# EAGLE design MarazLiteKumanda (EAGLE 9.6.1)
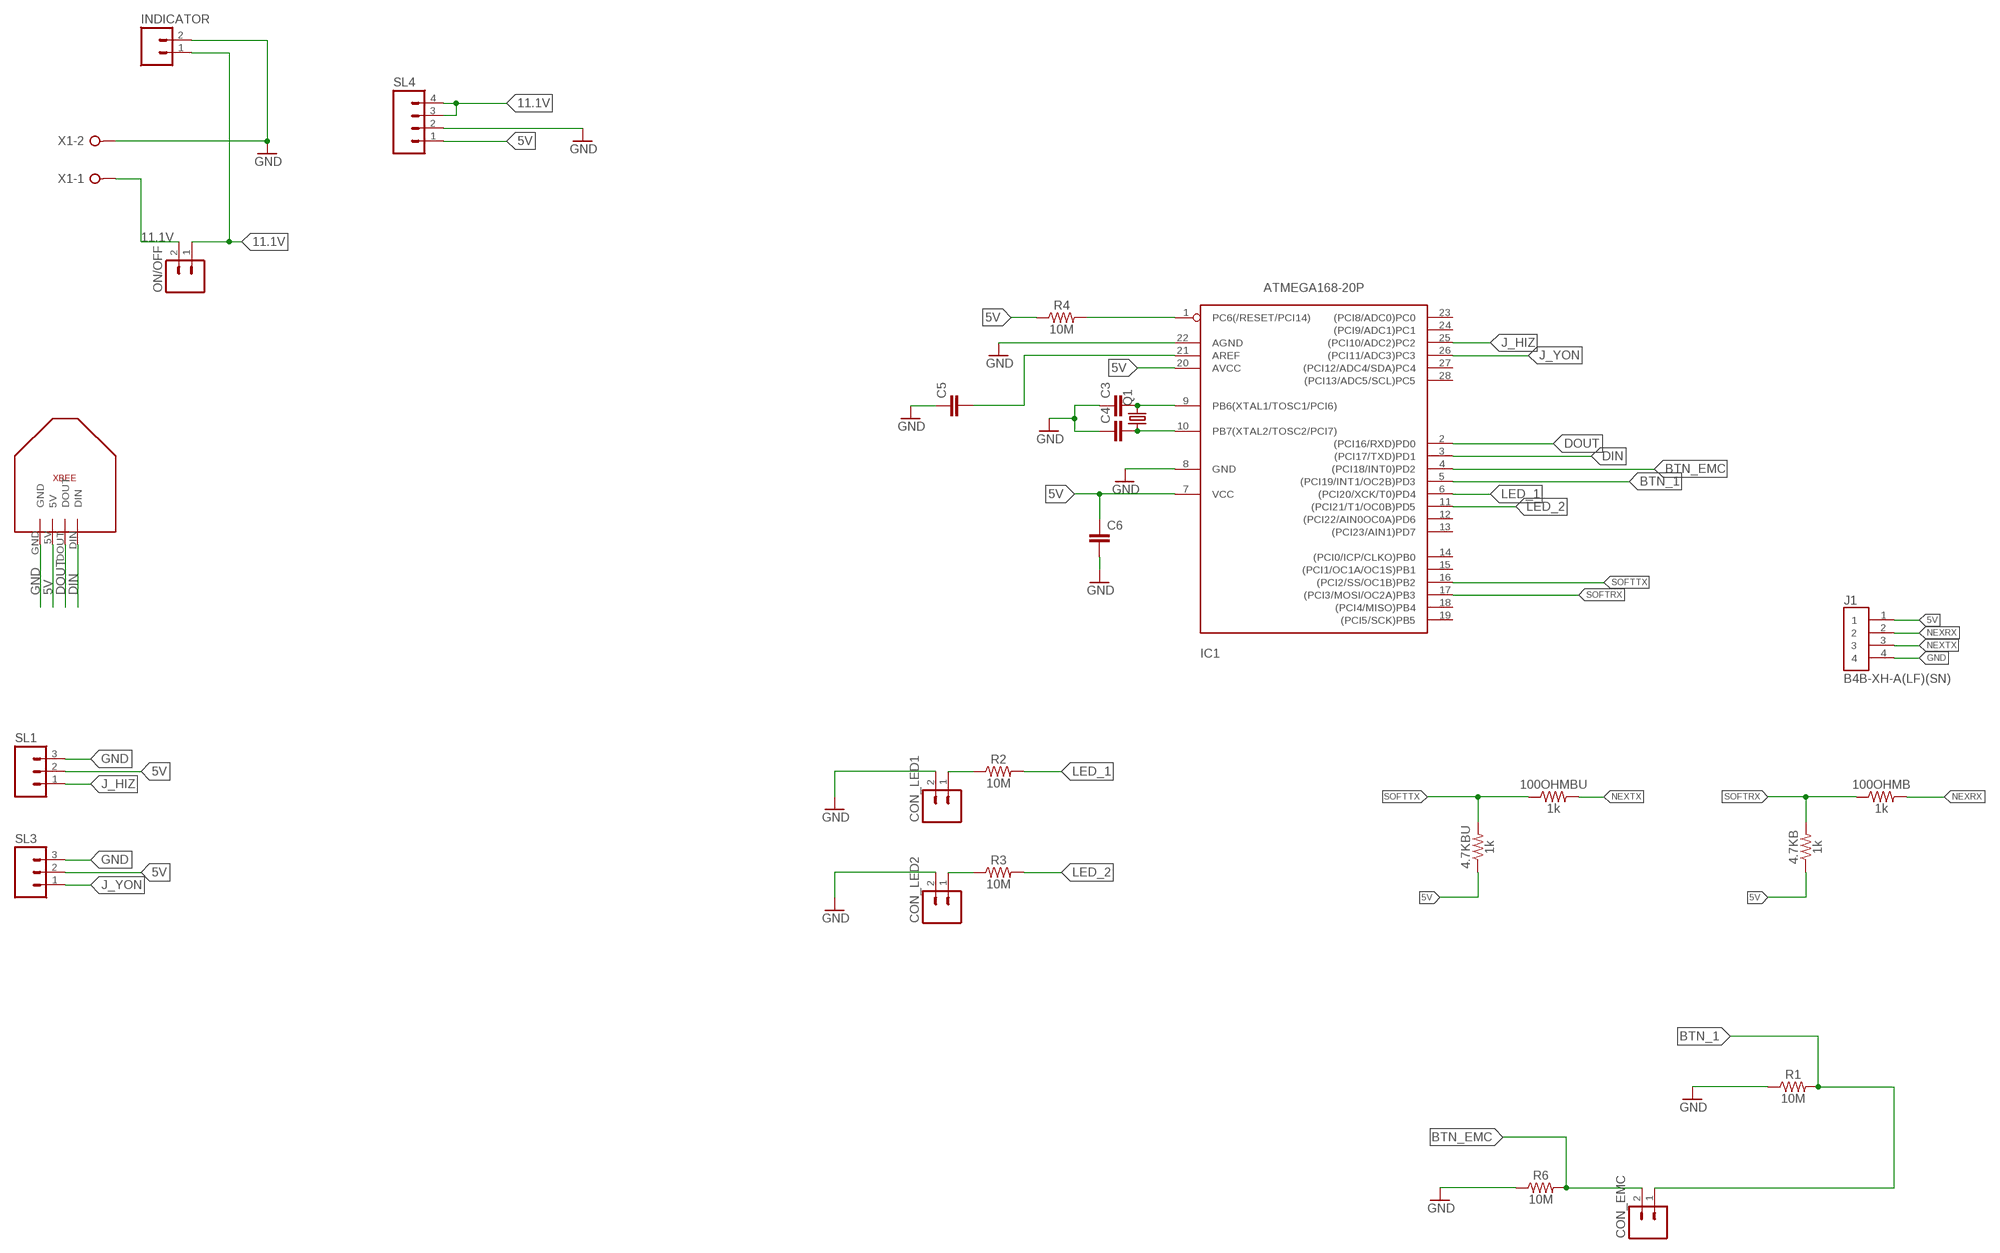
[diagram p0: schematic, sheet 1]

## Parts
4.7KB  1k  1KOHM-HORIZ-1/4W-5%  [AXIAL-0.3]
4.7KBU  1k  1KOHM-HORIZ-1/4W-5%  [AXIAL-0.3]
100OHMB  1k  1KOHM-HORIZ-1/4W-5%  [AXIAL-0.3]
100OHMBU  1k  1KOHM-HORIZ-1/4W-5%  [AXIAL-0.3]
C3  C2.5/2  [C2.5-2]
C4  C2.5/2  [C2.5-2]
C5  C2.5/2  [C2.5-2]
C6  C2.5/2  [C2.5-2]
CON_EMC  M02  [02P]
CON_LED1  M02  [02P]
CON_LED2  M02  [02P]
IC1  ATMEGA168-20P  [DIL28-3]
INDICATOR  M02  [02P]
J1  B4B-XH-A(LF)(SN)  [JST_B4B-XH-A(LF)(SN)]
ON/OFF  M02  [02P]
Q1  CRYSTALHC49U-V  [HC49U-V]
R1  10M  10MOHM-HORIZ-1/4W-5%  [AXIAL-0.3]
R2  10M  10MOHM-HORIZ-1/4W-5%  [AXIAL-0.3]
R3  10M  10MOHM-HORIZ-1/4W-5%  [AXIAL-0.3]
R4  10M  10MOHM-HORIZ-1/4W-5%  [AXIAL-0.3]
R6  10M  10MOHM-HORIZ-1/4W-5%  [AXIAL-0.3]
SL1  M03  [03P]
SL3  M03  [03P]
SL4  M04  [04P]
U$1  XBEE  [XBEE]
X1  W237-02P  [W237-132]

## Nets
5V: 4.7KB.P$1 4.7KBU.P$1 C6.1 IC1.7(VCC) IC1.20(AVCC) J1.1 R4.P$1 SL1.2 SL3.2 SL4.1 U$1.5V
11.1V: INDICATOR.1 ON/OFF.1 ON/OFF.2 SL4.3 SL4.4 X1.1
BTN_1: CON_EMC.1 IC1.5((PCI19/INT1/OC2B)PD3) R1.P$2
BTN_EMC: CON_EMC.2 IC1.4((PCI18/INT0)PD2) R6.P$2
DIN: IC1.3((PCI17/TXD)PD1) U$1.DIN
DOUT: IC1.2((PCI16/RXD)PD0) U$1.DOUT
GND: C3.1 C4.1 C5.1 C6.2 CON_LED1.2 CON_LED2.2 IC1.8(GND) IC1.22(AGND) INDICATOR.2 J1.4 R1.P$1 R6.P$1 SL1.3 SL3.3 SL4.2 U$1.GND X1.2
J_HIZ: IC1.25((PCI10/ADC2)PC2) SL1.1
J_YON: IC1.26((PCI11/ADC3)PC3) SL3.1
LED_1: IC1.6((PCI20/XCK/T0)PD4) R2.P$2
LED_2: IC1.11((PCI21/T1/OC0B)PD5) R3.P$2
N$1: C5.2 IC1.21(AREF)
N$5: CON_LED2.1 R3.P$1
N$6: CON_LED1.1 R2.P$1
N$8: C3.2 IC1.9(PB6(XTAL1/TOSC1/PCI6)) Q1.2
N$9: C4.2 IC1.10(PB7(XTAL2/TOSC2/PCI7)) Q1.1
N$17: IC1.1(PC6(/RESET/PCI14)) R4.P$2
NEXRX: 100OHMB.P$2 J1.2
NEXTX: 100OHMBU.P$2 J1.3
SOFTRX: 4.7KB.P$2 100OHMB.P$1 IC1.17((PCI3/MOSI/OC2A)PB3)
SOFTTX: 4.7KBU.P$2 100OHMBU.P$1 IC1.16((PCI2/SS/OC1B)PB2)
Unconnected: IC1.12((PCI22/AIN0OC0A)PD6) IC1.13((PCI23/AIN1)PD7) IC1.14((PCI0/ICP/CLKO)PB0) IC1.15((PCI1/OC1A/OC1S)PB1) IC1.18((PCI4/MISO)PB4) IC1.19((PCI5/SCK)PB5) IC1.23((PCI8/ADC0)PC0) IC1.24((PCI9/ADC1)PC1) IC1.27((PCI12/ADC4/SDA)PC4) IC1.28((PCI13/ADC5/SCL)PC5)

## Library data of the parts
4.7KB 4.7KBU 100OHMB 100OHMBU = SparkFun-Resistors-1k:1KOHM: 1kΩ resistor A resistor is a passive two-terminal electrical component that implements electrical resistance as a circuit element. Resistors act to reduce current flow, and, at the same time, act to lower voltage levels within circuits. - Wikipedia; PROD_ID: RES-08380
C3-C6 = capacitor-wima:C: CAPACITOR naming: grid - package width
CON_EMC CON_LED1 CON_LED2 INDICATOR ON/OFF = con-amp-quick:M02: AMP QUICK CONNECTOR; OC_FARNELL: unknown; OC_NEWARK: unknown
IC1 = adafruit:ATMEGA168*P: MICROCONTROLLER 16 kBytes FLASH 1 kBytes SRAM 512 Bytes EEPROM USART 8-channel 10 bit ADC
J1 = B4B-XH-A_LF__SN_:B4B-XH-A(LF)(SN): XH Series 4 Position 2.5 mm Pitch Through Hole Crimp Top Entry Shrouded Header; DESCRIPTION: Connector Header Through Hole 4 position 0.098 (2.50mm); DIGI-KEY_PART_NUMBER: 455-2249-ND; MF: JST Sales; MP: B4B-XH-A(LF)(SN); PACKAGE: None
Q1 = MarazLiteKumanda:CRYSTAL: CRYSTAL; OC_FARNELL: 1666969; OC_NEWARK: unknown
R1-R4 R6 = SparkFun-Resistors:10MOHM: RES-09327; PROD_ID: RES-09327
SL1 SL3 = con-amp-quick:M03: AMP QUICK CONNECTOR; OC_FARNELL: unknown; OC_NEWARK: unknown
SL4 = con-amp-quick:M04: AMP QUICK CONNECTOR; OC_FARNELL: unknown; OC_NEWARK: unknown
U$1 = MarazLite:XBEE
X1 = con-wago-508:W237-02P: WAGO SREW CLAMP; OC_FARNELL: unknown; OC_NEWARK: unknown

## Board
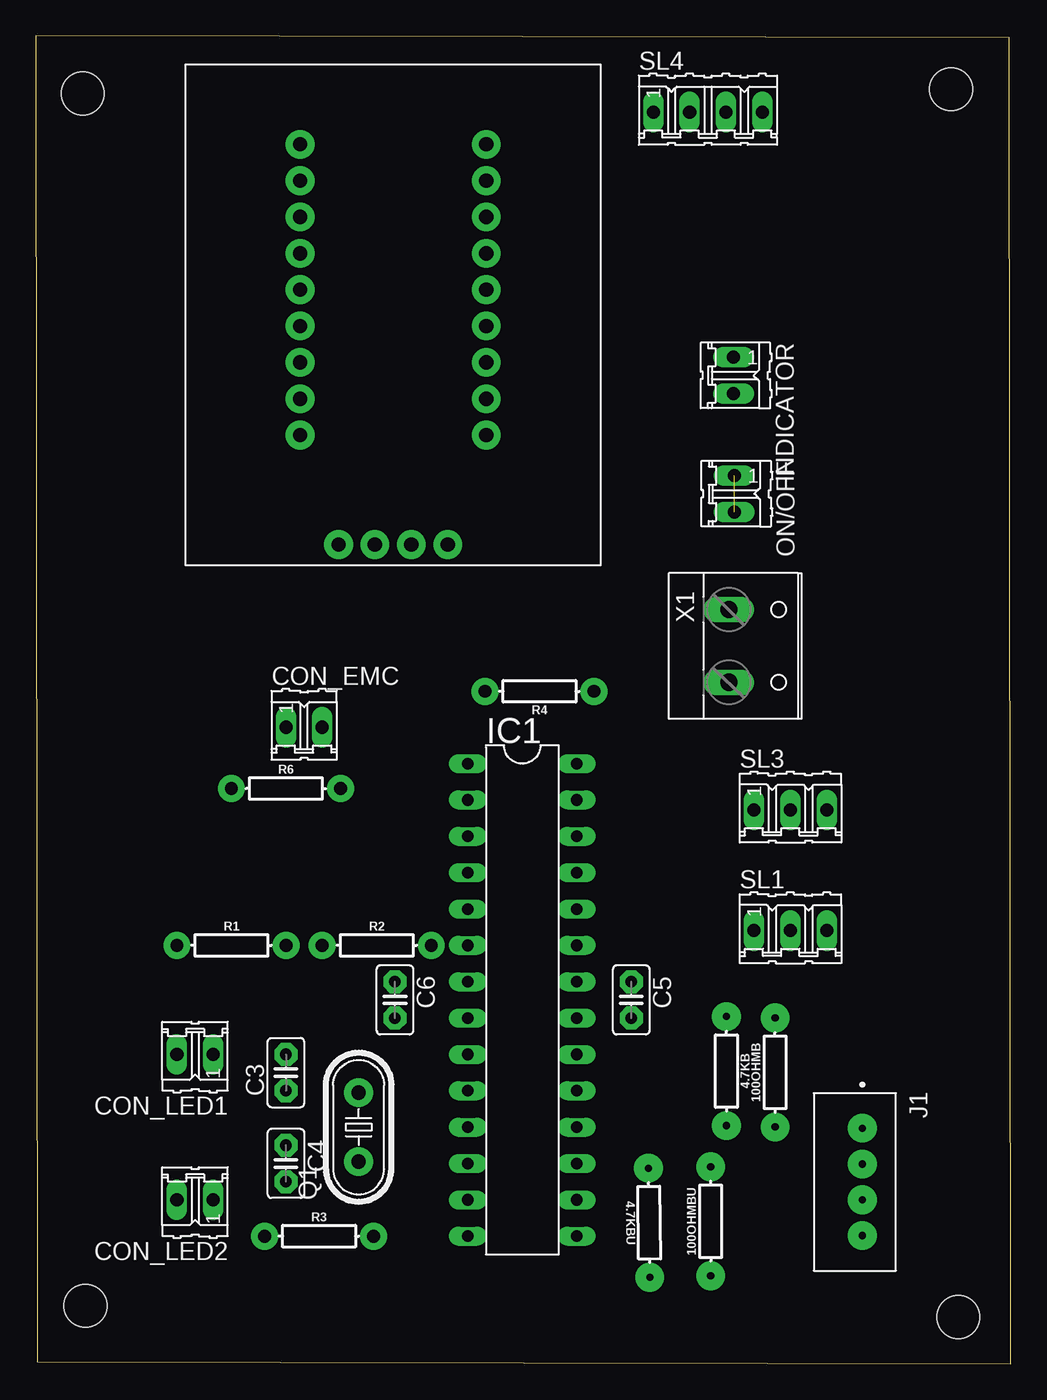
[diagram p1: board, top side]
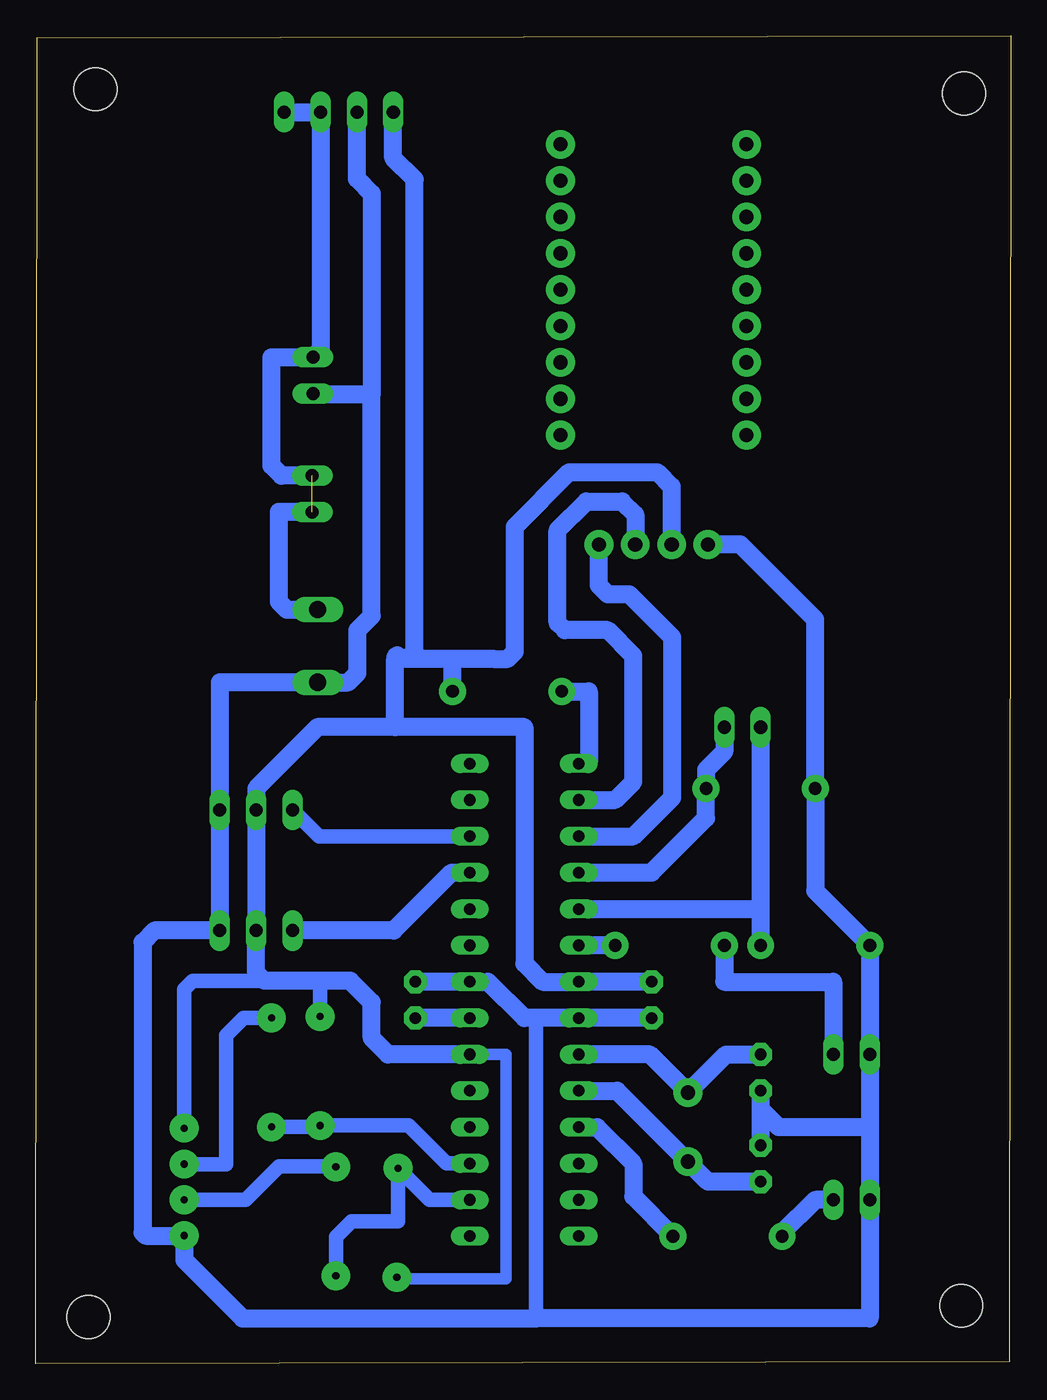
[diagram p2: board, bottom side, seen from below]

Size 68.13 x 92.78 mm. Coordinates in mm from the lower left corner, seen from the top.
Outline: 0.1,0.15 68.13,0 68.03,92.63 0,92.78 0.1,0.15
Copper layers (1*16): Top 0.035mm / dielectric 1.5mm / Bottom 0.035mm
Design rules "default": minimum track width 6mil, minimum drill 0.35mm, track to track 6mil, track to pad 6mil, pad to pad 6mil, via to via 6mil, smd to smd 6mil, copper to edge 40mil, drill to drill 6mil, minimum pad ring 10mil, minimum via ring 8mil, stop-mask expansion 4mil, vias tented up to drill 0mil, thermal gap 10mil
Holes 3 mm at 3.28,88.75 63.96,89.05 3.46,4.05 64.46,3.25

### Footprints (pad centres in the part's own frame; a part is rotated, then mirrored left to right if it is on the bottom)
AXIAL-0.3 = drill 0.5 pad 2: P$1 -3.81,0; P$2 3.81,0
C2.5-2 = drill 0.813 pad 1.6 octagon: 1 -1.27,0; 2 1.27,0
02P = drill 0.914 long: 1 -1.27,0; 2 1.27,0
DIL28-3 = drill 0.813 long: 1 -16.51,-3.81; 2 -13.97,-3.81; 3 -11.43,-3.81; 4 -8.89,-3.81; 5 -6.35,-3.81; 6 -3.81,-3.81; 7 -1.27,-3.81; 8 1.27,-3.81; 9 3.81,-3.81; 10 6.35,-3.81; 11 8.89,-3.81; 12 11.43,-3.81; 13 13.97,-3.81; 14 16.51,-3.81; 15 16.51,3.81; 16 13.97,3.81; 17 11.43,3.81; 18 8.89,3.81; 19 6.35,3.81; 20 3.81,3.81; 21 1.27,3.81; 22 -1.27,3.81; 23 -3.81,3.81; 24 -6.35,3.81; 25 -8.89,3.81; 26 -11.43,3.81; 27 -13.97,3.81; 28 -16.51,3.81
JST_B4B-XH-A(LF)(SN) = drill 0.5 pad 2: 1 0,0; 2 2.5,0; 3 5,0; 4 7.5,0
HC49U-V = drill 1 pad 2: 1 -2.413,0; 2 2.413,0
AXIAL-0.3' = drill 0.9 pad 1.88: P$1 -3.81,0; P$2 3.81,0
03P = drill 0.914 long: 1 -2.54,0; 2 0,0; 3 2.54,0
04P = drill 0.914 long: 1 -3.81,0; 2 -1.27,0; 3 1.27,0; 4 3.81,0
XBEE = drill 1 pad 2: 5V 1.77,15.533; DESTEK1 -6,-2.27; DESTEK2 -6,-4.81; DESTEK3 7,-2.27; DESTEK4 7,-4.81; DESTEK5 -6,0.27; DESTEK6 -6,2.81; DESTEK7 -6,5.35; DESTEK8 -6,7.89; DESTEK12 7,0.27; DESTEK13 7,2.81; DESTEK14 7,5.35; DESTEK15 7,7.89; DESTEK19 -6,-7.35; DESTEK20 -6,-9.89; DESTEK21 -6,-12.43; DESTEK22 7,-7.35; DESTEK23 7,-9.89; DESTEK24 7,-12.43; DIN -3.31,15.533; DOUT -0.77,15.533; GND 4.31,15.533
W237-132 = drill 1.194 long: 1 -2.54,-0.635; 2 2.54,-0.635

### Placement (x,y rotation side)
4.7KB  48.26,20.45 270 top
4.7KBU  42.86,9.85 90.7 top
100OHMB  51.66,20.35 90 top
100OHMBU  47.16,9.95 90 top
C3  17.48,20.34 90 top
C4  17.48,13.99 270 top
C5  41.61,25.42 270 top
C6  25.1,25.42 270 top
CON_EMC  18.75,44.47 0 top
CON_LED1  11.13,21.61 180 top
CON_LED2  11.13,11.45 180 top
IC1  33.99,25.42 270 top
INDICATOR  48.76,69.05 270 top
J1  57.76,16.45 270 top
ON/OFF  48.81,60.78 270 top
Q1  22.56,16.53 90 top
R1  10M  [AXIAL-0.3']  13.67,29.23 0 top
R2  10M  [AXIAL-0.3']  23.83,29.23 0 top
R3  10M  [AXIAL-0.3']  19.79,8.91 0 top
R4  10M  [AXIAL-0.3']  35.19,46.98 180 top
R6  10M  [AXIAL-0.3']  17.48,40.19 0 top
SL1  52.73,30.26 0 top
SL3  52.73,38.69 0 top
SL4  46.96,87.45 0 top
U$1  25.47,72.77 180 top
X1  49.06,50.15 270 top

### Tracks (layer width: path | path; a pad name or v marks a point on that pad's centre or on a via)
5V
  Bottom 0.813: IC1.20 35.26,21.61 35.26,5.95 42.82,5.95 4.7KBU.P$1
  Bottom 1.016: 52.16,26.75 57.16,26.75 57.76,26.15 J1.1 | 48.06,26.75 48.26,26.55 4.7KB.P$1
  Bottom 1.27: 43.02,44.47 33.99,44.47 33.99,27.96 32.72,26.69 IC1.7 C6.1 | 42.87,49.51 43.02,49.36 43.02,49.24 | 43.02,44.47 43.02,49.24 | R4.P$1 39,49.26 | 43.02,44.47 48.44,44.47 52.73,40.18 SL3.2 SL1.2 52.73,27.32 52.16,26.75 48.06,26.75 46.16,26.75 44.66,25.25 44.66,22.75 43.52,21.61 IC1.20 | 43.02,49.24 43,49.26 42.16,49.26 | 42.16,49.26 39,49.26 | 42.16,49.26 41.66,49.76 41.66,82.75 43.15,84.24 SL4.1 | 39,49.26 36.17,49.26 36.16,49.25 35.16,49.25 34.66,49.75 34.66,58.49 30.86,62.29 24.7,62.29 23.7,61.29 U$1.5V
11.1V  (1 unrouted)
  Bottom 1.27: SL4.4 SL4.3 48.23,70.85 INDICATOR.1 51.66,70.32 51.66,62.75 50.96,62.05 ON/OFF.1 | ON/OFF.2 51.16,59.51 51.16,53.25 50.6,52.69 X1.1
BTN_1
  Bottom 1.27: IC1.5 17.48,31.77 | 17.48,31.77 R1.P$2 | CON_EMC.1 17.48,31.77
BTN_EMC
  Bottom 1.27: IC1.4 25.1,34.31 21.29,38.12 R6.P$2 21.29,41.49 20.02,42.76 CON_EMC.2
DIN
  Bottom 1.27: IC1.3 26.37,36.85 23.66,39.56 23.66,50.75 26.66,53.75 28.16,53.75 28.78,54.37 U$1.DIN
DOUT
  Bottom 1.27: IC1.2 27.64,39.39 26.37,40.66 26.37,49.46 28.16,51.25 31.16,51.25 31.66,51.75 31.66,58.25 29.66,60.25 27.16,60.25 26.24,59.33 U$1.DOUT
GND
  Bottom 1.016: 33.16,24.15 33.16,3.17
  Bottom 1.27: C3.1 17.48,17.8 | 17.48,17.8 C4.1 | 9.86,16.53 CON_LED1.2 R1.P$1 13.67,33.04 R6.P$1 13.67,52.01 18.9,57.24 U$1.GND | 9.86,16.53 CON_LED2.2 9.86,3.17 33.16,3.17 53.68,3.17 57.76,7.25 J1.4 60.46,8.95 60.66,9.15 60.66,29.45 59.85,30.26 SL1.3 SL3.3 55.27,47.61 X1.2 46.3,47.61 45.66,48.25 45.66,51.25 44.66,52.25 44.66,67.75 | C5.1 IC1.22 36.53,26.69 33.99,24.15 33.16,24.15 IC1.8 C6.2 | 17.48,17.8 16.21,16.53 9.86,16.53 | SL4.2 45.69,82.78 44.66,81.75 44.66,67.75 | INDICATOR.2 48.73,67.75 44.66,67.75
J_HIZ
  Bottom 1.27: IC1.25 39.07,34.31 43.12,30.26 SL1.1
J_YON
  Bottom 1.016: SL3.1 48.35,36.85 IC1.26
LED_1
  Bottom 1.27: R2.P$2 IC1.6
LED_2
  Bottom 1.27: IC1.11 28.91,16.53 26.37,13.99 26.37,11.68 R3.P$2
N$1
  Bottom 1.27: IC1.21 C5.2
N$5
  Bottom 1.27: R3.P$1 15.98,9.14 13.67,11.45 CON_LED2.1
N$6
  Bottom 1.27: R2.P$1 20.02,26.69 12.4,26.69 CON_LED1.1
N$8
  Bottom 1.27: IC1.9 25.23,21.61 Q1.2 19.89,21.61 C3.2
N$9
  Bottom 1.27: IC1.10 27.51,19.07 Q1.1 21.16,12.72 C4.2
N$17
  Bottom 1.27: R4.P$2 29.48,46.98 29.48,42.03 29.58,41.93 IC1.1
NEXRX
  Bottom 1.016: 100OHMB.P$2 53.61,24.16 54.84,22.93 54.84,13.94 J1.2
NEXTX
  Bottom 1.016: J1.3 53.47,11.45 51.13,13.79 47.19,13.79 100OHMBU.P$2
SOFTRX
  Bottom 0.813: 48.36,16.54 4.7KB.P$2
  Bottom 1.016: 100OHMB.P$1 48.36,16.54 | 4.7KB.P$2 42.07,16.64 39.42,13.99 IC1.17
SOFTTX
  Bottom 1.016: 100OHMBU.P$1 47.16,8.87 46.07,9.96 42.83,9.96 42.81,9.98 4.7KBU.P$2 40.6,11.45 IC1.16